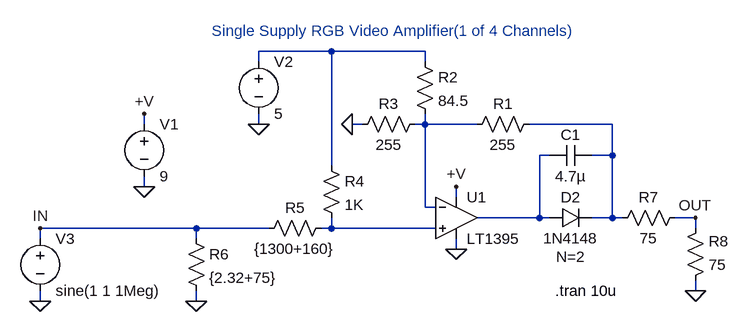
[diagram p0: schematic 1395.asc]
1395.asc, the LTspice schematic file:
Version 4
SHEET 1 896 680
WIRE 0 -16 -112 -16
WIRE 144 -16 0 -16
WIRE -112 0 -112 -16
WIRE 144 0 144 -16
WIRE -288 96 -288 80
WIRE -112 96 -112 80
WIRE 48 96 32 96
WIRE 144 96 144 80
WIRE 144 96 128 96
WIRE 224 96 144 96
WIRE 432 96 304 96
WIRE 336 144 320 144
WIRE 432 144 432 96
WIRE 432 144 400 144
WIRE 0 160 0 -16
WIRE -288 192 -288 176
WIRE 192 208 192 192
WIRE 144 224 144 96
WIRE 160 224 144 224
WIRE 320 240 320 144
WIRE 320 240 224 240
WIRE 336 240 320 240
WIRE 432 240 432 144
WIRE 432 240 400 240
WIRE 448 240 432 240
WIRE 560 240 528 240
WIRE -208 256 -448 256
WIRE -96 256 -208 256
WIRE 0 256 0 240
WIRE 0 256 -16 256
WIRE 160 256 0 256
WIRE 560 256 560 240
WIRE -448 272 -448 256
WIRE -208 272 -208 256
WIRE 192 288 192 272
WIRE 560 352 560 336
WIRE -448 368 -448 352
WIRE -208 368 -208 352
FLAG -288 192 0
FLAG 192 192 +V
FLAG -288 80 +V
FLAG 192 288 0
FLAG 32 96 0
FLAG -112 96 0
FLAG -208 368 0
FLAG -448 368 0
FLAG 560 240 OUT
FLAG 560 352 0
FLAG -448 256 IN
SYMBOL voltage -288 80 R0
SYMATTR InstName V1
SYMATTR Value 9
SYMBOL opamps\\LT1395 192 176 R0
SYMATTR InstName U1
SYMBOL diode 336 256 R270
WINDOW 0 32 32 VTop 2
WINDOW 3 0 32 VBottom 2
WINDOW 123 -28 32 VBottom 2
SYMATTR InstName D2
SYMATTR Value 1N4148
SYMATTR Value2 N=2
SYMBOL cap 400 128 R90
WINDOW 0 0 32 VBottom 2
WINDOW 3 32 32 VTop 2
SYMATTR InstName C1
SYMATTR Value 4.7µ
SYMBOL res 320 80 R90
WINDOW 0 0 56 VBottom 2
WINDOW 3 32 56 VTop 2
SYMATTR InstName R1
SYMATTR Value 255
SYMBOL res 128 -16 R0
SYMATTR InstName R2
SYMATTR Value 84.5
SYMBOL res 144 80 R90
WINDOW 0 0 56 VBottom 2
WINDOW 3 32 56 VTop 2
SYMATTR InstName R3
SYMATTR Value 255
SYMBOL voltage -112 -16 R0
SYMATTR InstName V2
SYMATTR Value 5
SYMBOL res -16 144 R0
SYMATTR InstName R4
SYMATTR Value 1K
SYMBOL res 0 240 R90
WINDOW 0 0 56 VBottom 2
WINDOW 3 32 56 VTop 2
SYMATTR InstName R5
SYMATTR Value {1300+160}
SYMBOL res -224 256 R0
SYMATTR InstName R6
SYMATTR Value {2.32+75}
SYMBOL voltage -448 256 R0
SYMATTR InstName V3
SYMATTR Value sine(1 1 1Meg)
SYMBOL res 544 224 R90
WINDOW 0 0 56 VBottom 2
WINDOW 3 32 56 VTop 2
SYMATTR InstName R7
SYMATTR Value 75
SYMBOL res 544 352 M180
WINDOW 0 36 76 Left 2
WINDOW 3 36 40 Left 2
SYMATTR InstName R8
SYMATTR Value 75
TEXT 344 352 Left 2 !.tran 10u
TEXT 96 -32 Bottom 2 ;Single Supply RGB Video Amplifier(1 of 4 Channels)

The netlist it stands for:
* 1395.asc
V1 +V 0 9
XU1 N005 N002 +V 0 N004 LT1395  ; pins In+ In- V+ V- OUT
D2 N004 N003 1N4148 N=2
C1 N003 N004 4.7µ
R1 N003 N002 255
R2 N001 N002 84.5
R3 N002 0 255
V2 N001 0 5
R4 N001 N005 1K
R5 N005 IN {1300+160}
R6 IN 0 {2.32+75}
V3 IN 0 sine(1 1 1Meg)
R7 OUT N003 75
R8 0 OUT 75
.model D D
.lib standard.dio
.tran 10u
* Single Supply RGB Video Amplifier(1 of 4 Channels)
.backanno
.end